# Altium project PCB_Project.PrjPcb
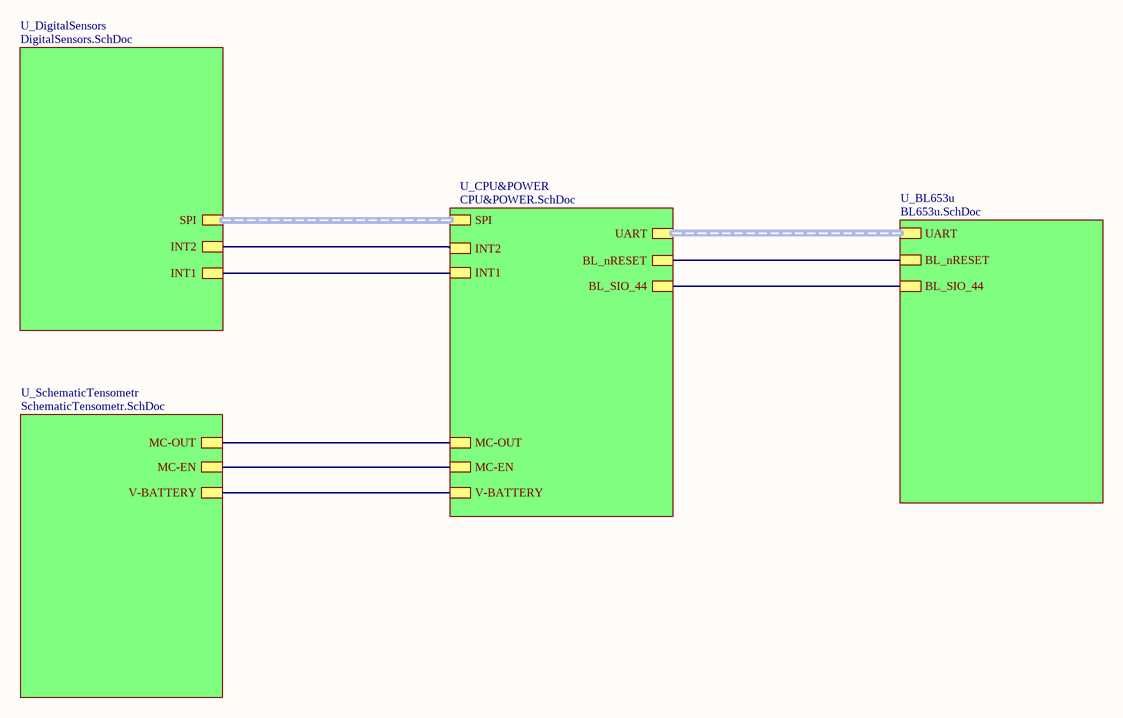
[diagram p0: Main.SchDoc]
5 sheets, 42 parts. Net scope: hierarchical (ports join the sheet entries above them; power ports are global).
Board file: PCB.PcbDoc
Sheets:
  Main.SchDoc
    U_BL653u = BL653u.SchDoc
    U_DigitalSensors = DigitalSensors.SchDoc
    U_CPU&POWER = CPU&POWER.SchDoc
    U_SchematicTensometr = SchematicTensometr.SchDoc

## Sheet Main.SchDoc: Sweet Dreams - Main
size 292 x 193 mm; Author: UnderPressure; CompanyName: Under Pressure; Organization: EiTI PW; SheetNumber: 1; SheetTotal: 5

### Sub-sheets
U_BL653u = BL653u.SchDoc: UART (harness BL_UART31), BL_nRESET, BL_SIO_44
U_CPU&POWER = CPU&POWER.SchDoc: SPI (harness SPI1), INT2, INT1, UART (harness BL_UART31), MC-OUT, MC-EN, BL_SIO_44, BL_nRESET, V-BATTERY
U_DigitalSensors = DigitalSensors.SchDoc: SPI (harness SPI1), INT1, INT2
U_SchematicTensometr = SchematicTensometr.SchDoc: MC-EN, MC-OUT, V-BATTERY

### Nets
Vbat: sheet U_CPU&POWER/V-BATTERY, sheet U_SchematicTensometr/V-BATTERY
NetIC12_4: sheet U_CPU&POWER/MC-OUT, sheet U_SchematicTensometr/MC-OUT
NetMCU1_7: sheet U_CPU&POWER/MC-EN, sheet U_SchematicTensometr/MC-EN
NetMCU1_14: sheet U_DigitalSensors/INT2, sheet U_CPU&POWER/INT2
NetMCU1_18: sheet U_DigitalSensors/INT1, sheet U_CPU&POWER/INT1
NetMCU1_25: sheet U_BL653u/BL_nRESET, sheet U_CPU&POWER/BL_nRESET
NetMCU1_26: sheet U_BL653u/BL_SIO_44, sheet U_CPU&POWER/BL_SIO_44

### Buses and harness runs
harness sheet U_BL653u/UART = sheet U_CPU&POWER/UART
harness sheet U_CPU&POWER/SPI = sheet U_DigitalSensors/SPI

### Notes on the sheet
- Data:
- Tytuł:
- Rev.:
- Rozm.:
- A4
- Strona:
- z
- PBL4
- Opracował:

## Sheet BL653u.SchDoc
size 292 x 193 mm; CompanyName: Politechnika Warszawska; Organization: EITI; Address1: Nowowiejska 15/19; Address2: 00-665 Warszawa; SheetNumber: 2; SheetTotal: 5; HTTPLink: www.pw.edu.pl
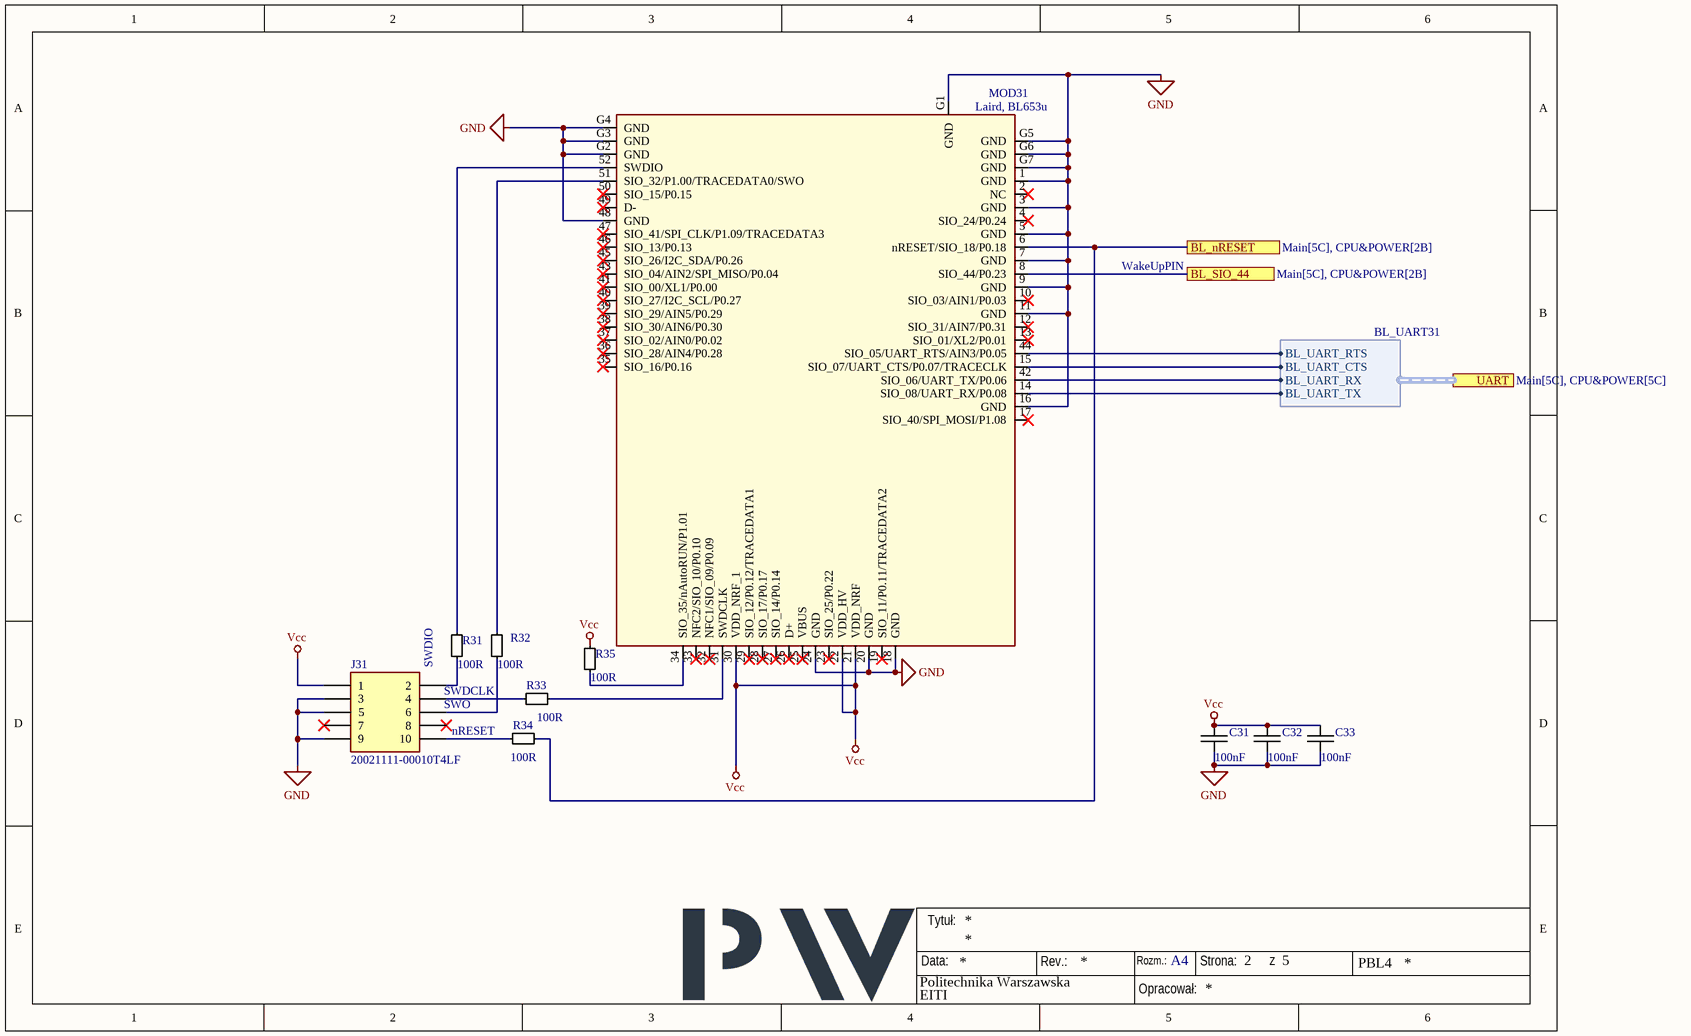
[diagram p1: BL653u.SchDoc]

### Parts
C31  100nF  [0402_CAP]
C32  100nF  [0402_CAP]
C33  100nF  [0402_CAP]
J31  20021111-00010T4LF  [HDRV10W41P127_2X5_635X343X575P_m]
MOD31  Laird, BL653u  [45300059C_m]
R31  100R  [0402_RES]
R32  100R  [0402_RES]
R33  100R  [0402_RES]
R34  100R  [0402_RES]
R35  100R  [0402_RES]

### Ports
BL_nRESET (see Main[5C], CPU&POWER[2B]), BL_SIO_44 (see Main[5C], CPU&POWER[2B]), UART (harness BL_UART31, see Main[5C], CPU&POWER[5C])

### Harnesses
BL_UART31: BL_UART_RTS, BL_UART_CTS, BL_UART_RX, BL_UART_TX

### Nets
GND: C31.2 C32.2 C33.2 J31.3 J31.5 J31.9 MOD31.1(GND) MOD31.3(GND) MOD31.5(GND) MOD31.7(GND) MOD31.9(GND) MOD31.11(GND) MOD31.16(GND) MOD31.18(GND) MOD31.20(GND) MOD31.24(GND) MOD31.48(GND) MOD31.G1(GND) MOD31.G2(GND) MOD31.G3(GND) MOD31.G4(GND) MOD31.G5(GND) MOD31.G6(GND) MOD31.G7(GND)
Vcc: C31.1 C32.1 C33.1 J31.1 MOD31.21(VDD_NRF) MOD31.22(VDD_HV) MOD31.30(VDD_NRF_1) R35.1
NetJ31_2: J31.2 R31.1
NetJ31_4: J31.4 R33.2
NetJ31_6: J31.6 R32.1
NetJ31_10: J31.10 R34.2
NetMCU1_19: MOD31.42(SIO_06/UART_TX/P0.06) ; port UART.BL_UART_RX
NetMCU1_20: MOD31.14(SIO_08/UART_RX/P0.08) ; port UART.BL_UART_TX
NetMCU1_21: MOD31.44(SIO_05/UART_RTS/AIN3/P0.05) ; port UART.BL_UART_RTS
NetMCU1_22: MOD31.15(SIO_07/UART_CTS/P0.07/TRACECLK) ; port UART.BL_UART_CTS
NetMCU1_25: MOD31.6(nRESET/SIO_18/P0.18) R34.1 ; port BL_nRESET
NetMCU1_26: MOD31.8(SIO_44/P0.23) ; port BL_SIO_44
NetMOD31_31: MOD31.31(SWDCLK) R33.1
NetMOD31_34: MOD31.34(SIO_35/nAutoRUN/P1.01) R35.2
NetMOD31_51: MOD31.51(SIO_32/P1.00/TRACEDATA0/SWO) R32.2
NetMOD31_52: MOD31.52(SWDIO) R31.2

Not connected (* = marked no-connect by the designer): J31 7* 8*; MOD31 2(NC)* 4(SIO_24/P0.24)* 10(SIO_03/AIN1/P0.03)* 12(SIO_31/AIN7/P0.31)* 13(SIO_01/XL2/P0.01)* 17(SIO_40/SPI_MOSI/P1.08)* 19(SIO_11/P0.11/TRACEDATA2)* 23(SIO_25/P0.22___________)* 25(VBUS)* 26(D+)* 27(SIO_14/P0.14)* 28(SIO_17/P0.17)* 29(SIO_12/P0.12/TRACEDATA1)* 32(NFC1/SIO_09/P0.09)* 33(NFC2/SIO_10/P0.10)* 35(SIO_16/P0.16)* 36(SIO_28/AIN4/P0.28)* 37(SIO_02/AIN0/P0.02)* 38(SIO_30/AIN6/P0.30)* 39(SIO_29/AIN5/P0.29)* 40(SIO_27/I2C_SCL/P0.27)* 41(SIO_00/XL1/P0.00)* 43(SIO_04/AIN2/SPI_MISO/P0.04)* 45(SIO_26/I2C_SDA/P0.26)* 46(SIO_13/P0.13)* 47(SIO_41/SPI_CLK/P1.09/TRACEDATA3)* 49(D-)* 50(SIO_15/P0.15)*

### Notes on the sheet
- WakeUpPIN
- SWDIO
- (near J31) SWO
- SWDCLK
- nRESET
- Data:
- Tytuł:
- Rev.:
- Rozm.:
- A4
- Strona:
- z
- PBL4
- Opracował:

### Library data of the parts
C31-C33 = Capacitor_1: Ceramic Capacitor; Parameter 1: 100nF
J31 = 20021111-00010T4LF: Connector; Manufacturer_Name: Amphenol Communications Solutions; Datasheet Link: https://cdn.amphenol-cs.com/media/wysiwyg/files/drawing/20021111.pdf; Height: 5.75mm; Manufacturer_Part_Number: 20021111-00010T4LF; Mouser Part Number: 649-221111-00010T4LF; Mouser Price/Stock: https://www.mouser.co.uk/ProductDetail/Amphenol-FCI/20021111-00010T4LF?qs=nwYJ12Fl9gR8B5xkaYs9gA%3D%3D; Arrow Part Number: 20021111-00010T4LF; Arrow Price/Stock: https://www.arrow.com/en/products/20021111-00010t4lf/amphenol-fci?region=europe
MOD31 = Laird, BL653u: BL653µ Integrated Antenna module, 453-00059; Substitutes Allowed: NO; Datasheet Link: https://connectivity-staging.s3.us-east-2.amazonaws.com/s3fs-public/2018-12/BL654%20Datasheet%20v1_6.pdf; Mounting: SMT; Operating Temperature: -40C~85C; Manufacturer Part Number: 453-00059; Footprint: Laird, Module, BL653u-SA; Manufacturer: Laird
R31-R35 = Resistor: Parameter 1: 100R

## Sheet DigitalSensors.SchDoc: Digital sensors
size 292 x 193 mm; Author: Natalia Krzykała; CompanyName: Politechnika Warszawska; Organization: EITI; Address1: Nowowiejska 15/19; Address2: 00-665 Warszawa; Revision: 3; SheetNumber: 3; SheetTotal: 5; HTTPLink: www.pw.edu.pl; Group_Name: Under Pressure; ProjName: Sweet Dreams
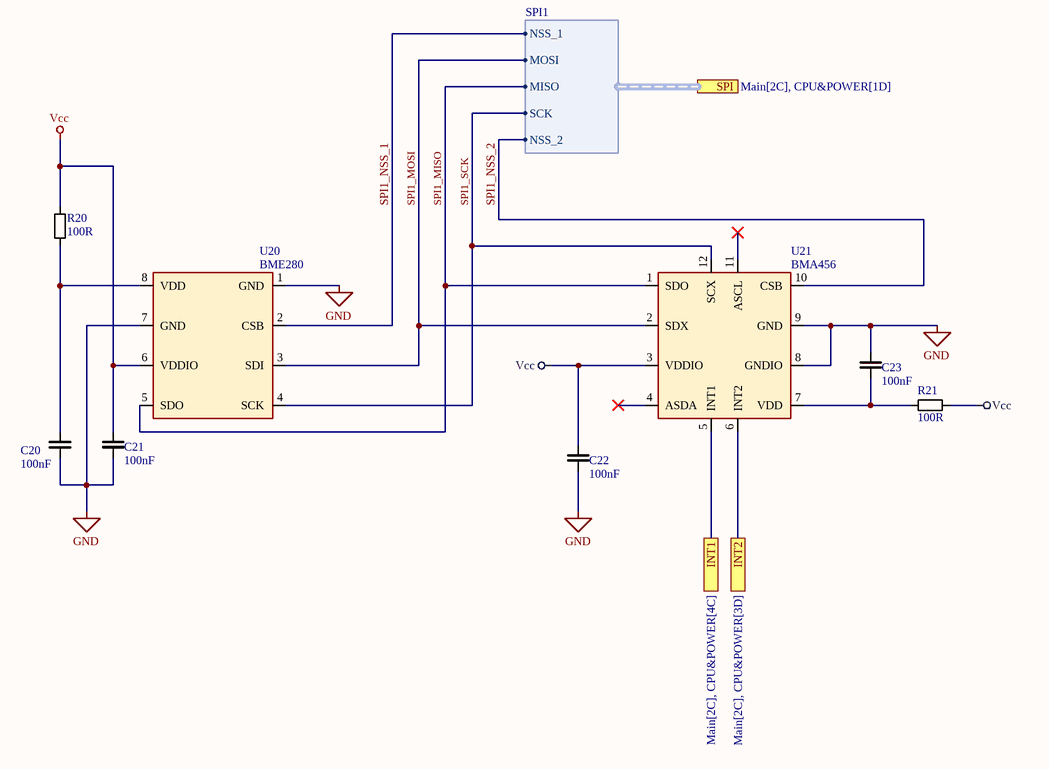
[diagram p2: DigitalSensors.SchDoc]

### Parts
C20  100nF  [0402_CAP]
C21  100nF  [0402_CAP]
C22  100nF  [0402_CAP]
C23  100nF  [0402_CAP]
R20  100R  [0402_RES]
R21  100R  [0402_RES]
U20  BME280  [MODBME280_m]
U21  BMA456  [BOSCH_LGA-12]

### Ports
INT1 (see Main[2C], CPU&POWER[4C]), INT2 (see Main[2C], CPU&POWER[3D]), SPI (harness SPI1, see Main[2C], CPU&POWER[1D])

### Harnesses
SPI1: MOSI, MISO, SCK, NSS_1, NSS_2

### Nets
GND: C20.1 C21.1 C22.1 C23.2 U20.1(GND) U20.7(GND) U21.8(GNDIO) U21.9(GND)
Vcc: C21.2 C22.2 R20.2 R21.2 U20.6(VDDIO) U21.3(VDDIO)
SPI1_MISO: U20.5(SDO) U21.1(SDO) ; port SPI.MISO
SPI1_MOSI: U20.3(SDI) U21.2(SDX) ; port SPI.MOSI
SPI1_NSS_1: U20.2(CSB) ; port SPI.NSS_1
SPI1_NSS_2: U21.10(CSB) ; port SPI.NSS_2
SPI1_SCK: U20.4(SCK) U21.12(SCX) ; port SPI.SCK
NetC20_2: C20.2 R20.1 U20.8(VDD)
NetC23_1: C23.1 R21.1 U21.7(VDD)
NetMCU1_14: U21.6(INT2) ; port INT2
NetMCU1_18: U21.5(INT1) ; port INT1

Not connected (* = marked no-connect by the designer): U21 4(ASDA)* 11(ASCL)*

### Notes on the sheet
- Data:
- Tytuł:
- Rev.:
- Rozm.:
- A4
- Strona:
- z
- PBL4
- Opracował:

### Library data of the parts
C20-C23 = Cap: Ceramic capacitor
R20 R21 = RES: Resistor

## Sheet CPU&POWER.SchDoc: MCU&Power
size 292 x 193 mm; Author: Michał Borkowski; CompanyName: Politechnika Warszawska; Organization: WEITI; Revision: 3; SheetNumber: 5; SheetTotal: 5; ProjName: Sweet Dreams; Group_Name: Under Pressure
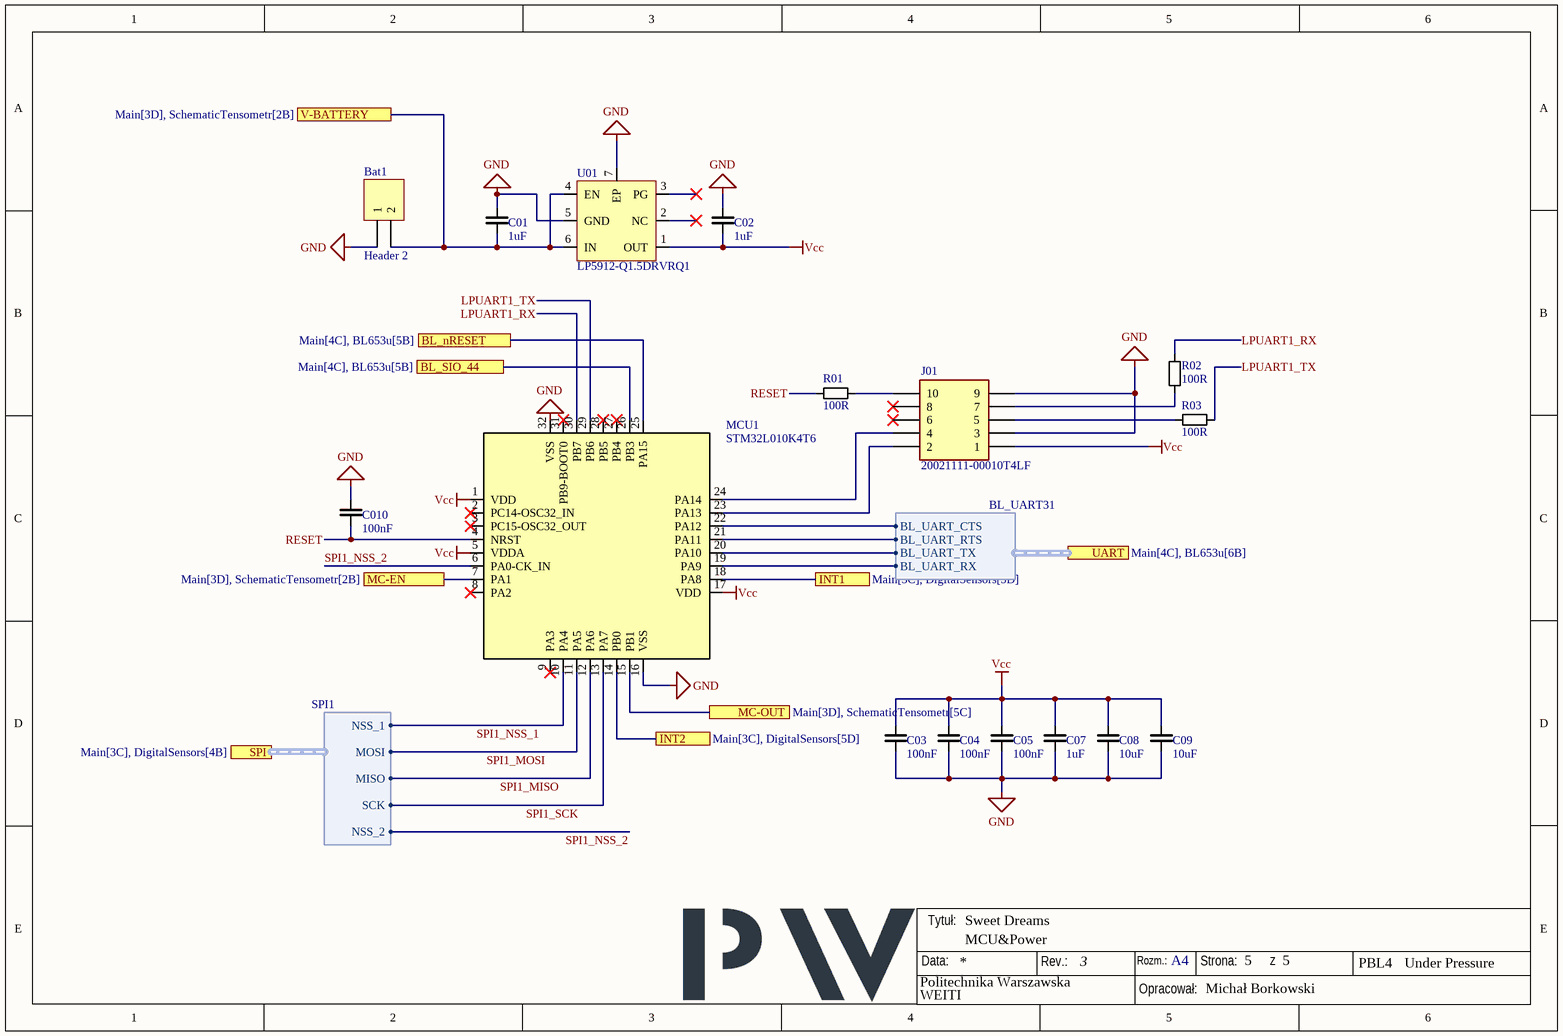
[diagram p3: CPU&POWER.SchDoc]

### Parts
Bat1  Header 2  [HDR1X2]
C01  1uF  [0402_CAP]
C02  1uF  [0402_CAP]
C03  100nF  [0402_CAP]
C04  100nF  [0402_CAP]
C05  100nF  [0402_CAP]
C07  1uF  [0402_CAP]
C08  10uF  [0402_CAP]
C09  10uF  [0402_CAP]
C010  100nF  [0402_CAP]
J01  20021111-00010T4LF  [HDRV10W41P127_2X5_635X343X575P_m]
MCU1  STM32L010K4T6  [QFP80P900X900X160-32N_m]
R01  100R  [0402_RES]
R02  100R  [0402_RES]
R03  100R  [0402_RES]
U01  LP5912-Q1.5DRVRQ1  [SON65P200X200X80-7N_m]

### Ports
BL_nRESET (see Main[4C], BL653u[5B]), BL_SIO_44 (see Main[4C], BL653u[5B]), INT1 (see Main[3C], DigitalSensors[5D]), INT2 (see Main[3C], DigitalSensors[5D]), MC-EN (see Main[3D], SchematicTensometr[2B]), MC-OUT (see Main[3D], SchematicTensometr[5C]), SPI (harness SPI1, see Main[3C], DigitalSensors[4B]), UART (harness BL_UART31, see Main[4C], BL653u[6B]), V-BATTERY (see Main[3D], SchematicTensometr[2B])

### Harnesses
SPI1: NSS_1, MOSI, MISO, SCK, NSS_2
BL_UART31: BL_UART_RTS, BL_UART_CTS, BL_UART_RX, BL_UART_TX

### Nets
GND: Bat1.1 C01.2 C02.2 C03.1 C04.1 C05.1 C07.1 C08.1 C09.1 C010.2 J01.3 J01.9 MCU1.16(VSS) MCU1.32(VSS) U01.5(GND) U01.7(EP)
Vbat: Bat1.2 C01.1 U01.4(EN) U01.6(IN) ; port V-BATTERY
Vcc: C02.1 C03.2 C04.2 C05.2 C07.2 C08.2 C09.2 J01.1 MCU1.1(VDD) MCU1.5(VDDA) MCU1.17(VDD) U01.1(OUT)
LPUART1_RX: MCU1.30(PB7) R02.2
LPUART1_TX: MCU1.29(PB6) R03.1
RESET: C010.1 MCU1.4(NRST) R01.1
SPI1_MISO: MCU1.12(PA6) ; port SPI.MISO
SPI1_MOSI: MCU1.11(PA5) ; port SPI.MOSI
SPI1_NSS_1: MCU1.10(PA4) ; port SPI.NSS_1
SPI1_NSS_2: MCU1.6(PA0-CK_IN) ; port SPI.NSS_2
SPI1_SCK: MCU1.13(PA7) ; port SPI.SCK
NetIC12_4: MCU1.15(PB1) ; port MC-OUT
NetJ01_2: J01.2 MCU1.23(PA13)
NetJ01_4: J01.4 MCU1.24(PA14)
NetJ01_5: J01.5 R03.2
NetJ01_7: J01.7 R02.1
NetJ01_10: J01.10 R01.2
NetMCU1_7: MCU1.7(PA1) ; port MC-EN
NetMCU1_14: MCU1.14(PB0) ; port INT2
NetMCU1_18: MCU1.18(PA8) ; port INT1
NetMCU1_19: MCU1.19(PA9) ; port UART.BL_UART_RX
NetMCU1_20: MCU1.20(PA10) ; port UART.BL_UART_TX
NetMCU1_21: MCU1.21(PA11) ; port UART.BL_UART_RTS
NetMCU1_22: MCU1.22(PA12) ; port UART.BL_UART_CTS
NetMCU1_25: MCU1.25(PA15) ; port BL_nRESET
NetMCU1_26: MCU1.26(PB3) ; port BL_SIO_44

Not connected (* = marked no-connect by the designer): J01 6* 8*; MCU1 2(PC14-OSC32_IN)* 3(PC15-OSC32_OUT)* 8(PA2)* 9(PA3)* 27(PB4)* 28(PB5)* 31(PB9-BOOT0)*; U01 2(NC)* 3(PG)*

### Notes on the sheet
- Data:
- Tytuł:
- Rev.:
- Rozm.:
- A4
- Strona:
- z
- PBL4
- Opracował:

### Library data of the parts
Bat1 = Header 2: Header, 2-Pin; LatestRevisionDate: 17-Jul-2002; LatestRevisionNote: Re-released for DXP Platform.; Publisher: Altium Limited
C01 C02 C03 C04 C05 C07 C08 C09 C010 = Cap: Ceramic capacitor
J01 = 20021111-00010T4LF: as J31 on sheet BL653u; Datasheet Link: https://cdn.amphenol-cs.com/media/wysiwyg/files/drawing/20021111.pdf; Height: 5.75mm; Manufacturer_Part_Number: 20021111-00010T4LF; Mouser Part Number: 649-221111-00010T4LF; Mouser Price/Stock: https://www.mouser.co.uk/ProductDetail/Amphenol-FCI/20021111-00010T4LF?qs=nwYJ12Fl9gR8B5xkaYs9gA%3D%3D; Arrow Part Number: 20021111-00010T4LF; Arrow Price/Stock: https://www.arrow.com/en/products/20021111-00010t4lf/amphenol-fci?region=europe
MCU1 = CPU32p
R01 R02 R03 = RES: Resistor
U01 = STAB

## Sheet SchematicTensometr.SchDoc: Tensometer
size 292 x 193 mm; Author: Mikołaj Roszczyk; CompanyName: Politechnika Warszawska; Organization: WEITI; Revision: 5; SheetNumber: 4; SheetTotal: 5; Group_Name: Under Pressure; ProjName: Sweet Dreams
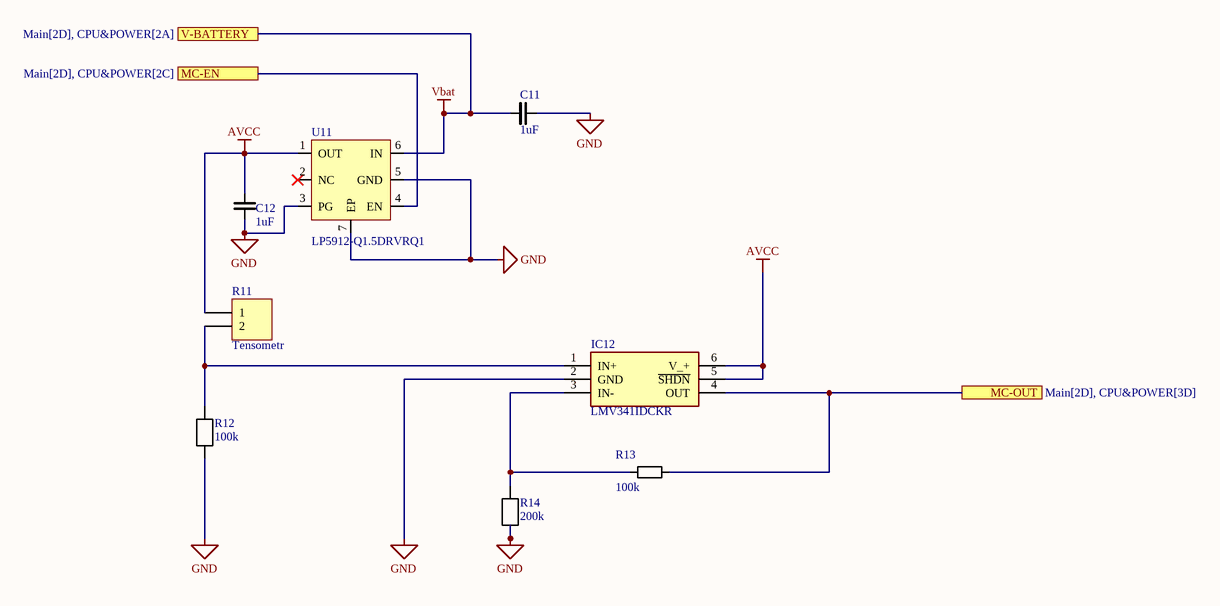
[diagram p4: SchematicTensometr.SchDoc]

### Parts
C11  1uF  [0402_CAP]
C12  1uF  [0402_CAP]
IC12  LMV341IDCKR  [SOT65P210X110-6N_m]
R11  Tensometr  [HDR1X2]
R12  100k  [0402_RES]
R13  100k  [0402_RES]
R14  200k  [0402_RES]
U11  LP5912-Q1.5DRVRQ1  [SON65P200X200X80-7N_m]

### Ports
MC-EN (see Main[2D], CPU&POWER[2C]), MC-OUT (see Main[2D], CPU&POWER[3D]), V-BATTERY (see Main[2D], CPU&POWER[2A])

### Nets
AVCC: C12.2 IC12.5(~{SHDN}) IC12.6(V_+) R11.1 U11.1(OUT)
GND: C11.1 C12.1 IC12.2(GND) R12.2 R14.2 U11.3(PG) U11.5(GND) U11.7(EP)
Vbat: C11.2 U11.6(IN) ; port V-BATTERY
NetIC12_1: IC12.1(IN+) R11.2 R12.1
NetIC12_3: IC12.3(IN-) R13.1 R14.1
NetIC12_4: IC12.4(OUT) R13.2 ; port MC-OUT
NetMCU1_7: U11.4(EN) ; port MC-EN

Not connected (* = marked no-connect by the designer): U11 2(NC)*

### Notes on the sheet
- Data:
- Tytuł:
- Rev.:
- Rozm.:
- A4
- Strona:
- z
- PBL4
- Opracował:

### Library data of the parts
C11 C12 = Cap: Ceramic capacitor
IC12 = LMV341IDCKR: Integrated Circuit; Manufacturer_Name: Texas Instruments; Datasheet Link: http://www.ti.com/lit/gpn/lmv341; Height: 1.1mm; Manufacturer_Part_Number: LMV341IDCKR; Mouser Part Number: 595-LMV341IDCKR; Mouser Price/Stock: https://www.mouser.co.uk/ProductDetail/Texas-Instruments/LMV341IDCKR/?qs=paYhMW8qfiso3OfEEvyk%2Fg%3D%3D; Arrow Part Number: LMV341IDCKR; Arrow Price/Stock: https://www.arrow.com/en/products/lmv341idckr/texas-instruments
R11 = Header 2: Header, 2-Pin; LatestRevisionDate: 17-Jul-2002; LatestRevisionNote: Re-released for DXP Platform.; Publisher: Altium Limited
R12 R14 = Resistor
R13 = RES: Resistor
U11 = STAB

## Nets that join several sheets
GND: BL653u (24 pins), DigitalSensors (8 pins), CPU&POWER (16 pins), SchematicTensometr (8 pins)
Vbat: CPU&POWER (Bat1.2 C01.1 U01.4 U01.6), SchematicTensometr (C11.2 U11.6)
Vcc: BL653u (8 pins), DigitalSensors (6 pins), CPU&POWER (12 pins)
NetIC12_4: CPU&POWER (MCU1.15), SchematicTensometr (IC12.4 R13.2)
NetMCU1_7: CPU&POWER (MCU1.7), SchematicTensometr (U11.4)
NetMCU1_14: DigitalSensors (U21.6), CPU&POWER (MCU1.14)
NetMCU1_18: DigitalSensors (U21.5), CPU&POWER (MCU1.18)
NetMCU1_19: BL653u (MOD31.42), CPU&POWER (MCU1.19)
NetMCU1_20: BL653u (MOD31.14), CPU&POWER (MCU1.20)
NetMCU1_21: BL653u (MOD31.44), CPU&POWER (MCU1.21)
NetMCU1_22: BL653u (MOD31.15), CPU&POWER (MCU1.22)
NetMCU1_25: BL653u (MOD31.6 R34.1), CPU&POWER (MCU1.25)
NetMCU1_26: BL653u (MOD31.8), CPU&POWER (MCU1.26)
SPI1_MISO: DigitalSensors (U20.5 U21.1), CPU&POWER (MCU1.12)
SPI1_MOSI: DigitalSensors (U20.3 U21.2), CPU&POWER (MCU1.11)
SPI1_NSS_1: DigitalSensors (U20.2), CPU&POWER (MCU1.10)
SPI1_NSS_2: DigitalSensors (U21.10), CPU&POWER (MCU1.6)
SPI1_SCK: DigitalSensors (U20.4 U21.12), CPU&POWER (MCU1.13)